# Altium schematic sheet MotorCell_noPow.SchDoc
size A3; SheetNumber: 3
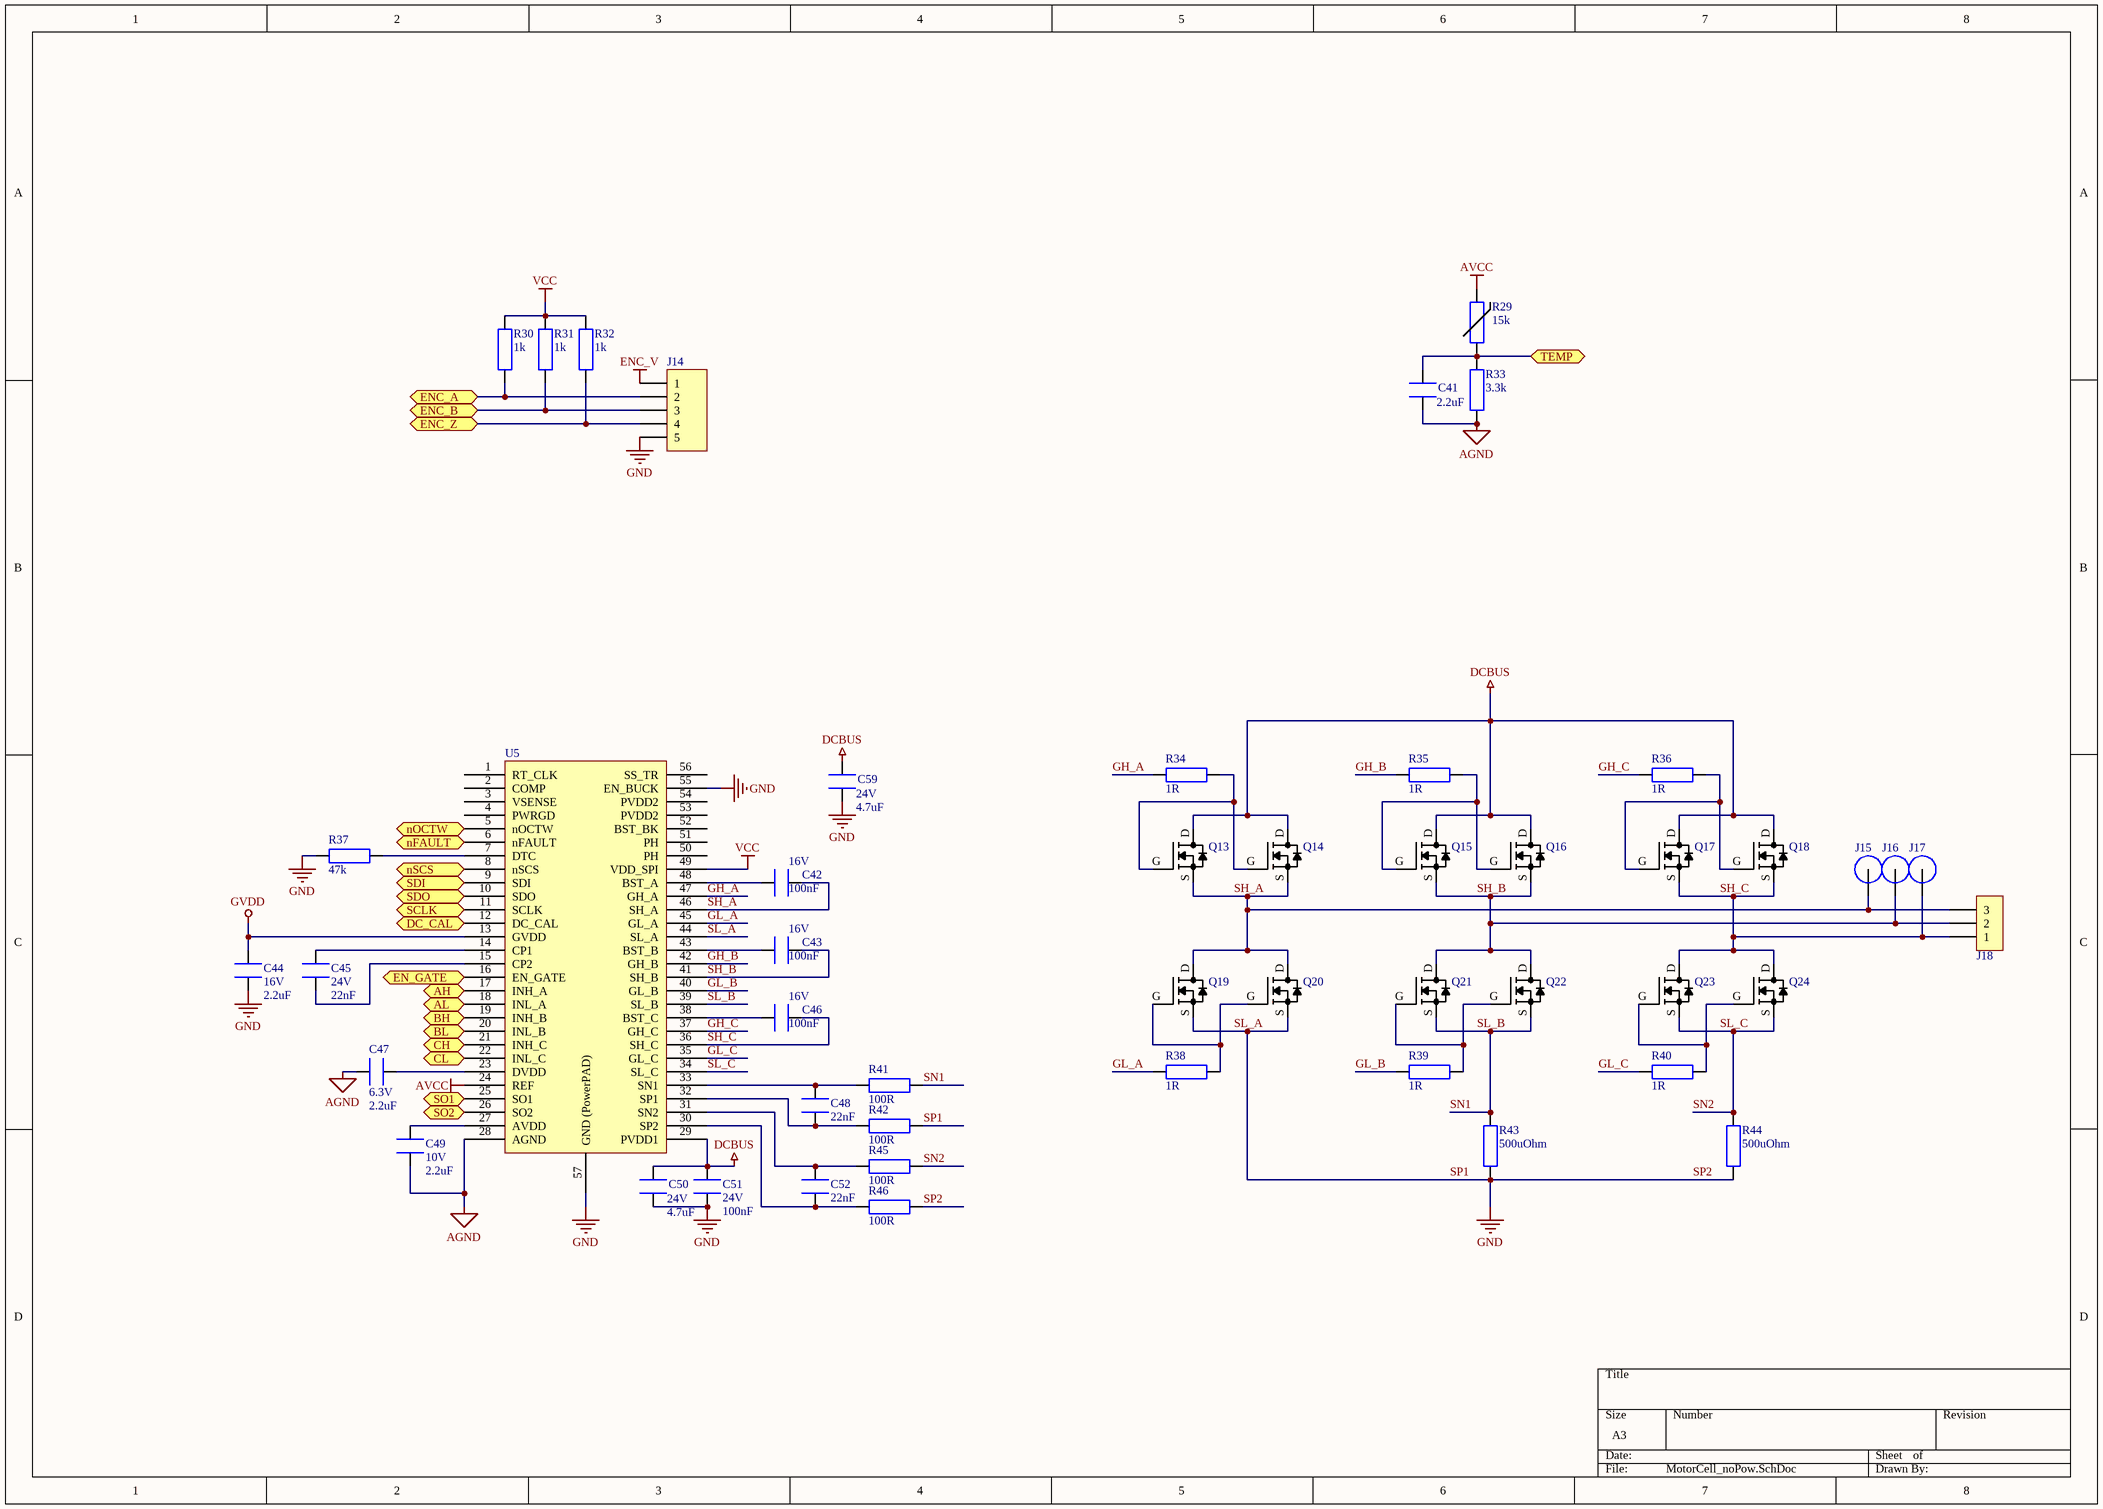
[diagram p0: MotorCell_noPow.SchDoc]

## Parts
C41  value 2.2uF  [1608[0603]]
C42  16V  value 100nF  [1608[0603]]
C43  16V  value 100nF  [1608[0603]]
C44  16V  value 2.2uF  [1608[0603]]
C45  24V  value 22nF  [1608[0603]]
C46  16V  value 100nF  [1608[0603]]
C47  6.3V  value 2.2uF  [1608[0603]]
C48  value 22nF  [1608[0603]]
C49  10V  value 2.2uF  [1608[0603]]
C50  24V  value 4.7uF  [CAPC2012X09N]
C51  24V  value 100nF  [1608[0603]]
C52  value 22nF  [1608[0603]]
C59  24V  value 4.7uF  [CAPC2012X09N]
J14  (no value)  [HDR1X5]
J15  (no value)  [M3 Spade Hole]
J16  (no value)  [M3 Spade Hole]
J17  (no value)  [M3 Spade Hole]
J18  (no value)  [MC000051]
Q13  (no value)  [SO8FL]
Q14  (no value)  [SO8FL_FILL]
Q15  (no value)  [SO8FL]
Q16  (no value)  [SO8FL_FILL]
Q17  (no value)  [SO8FL]
Q18  (no value)  [SO8FL_FILL]
Q19  (no value)  [SO8FL]
Q20  (no value)  [SO8FL]
Q21  (no value)  [SO8FL]
Q22  (no value)  [SO8FL]
Q23  (no value)  [SO8FL]
Q24  (no value)  [SO8FL]
R29  value 15k  [RESC1608X06L]
R30  value 1k  [RESC1608X55N]
R31  value 1k  [RESC1608X55N]
R32  value 1k  [RESC1608X55N]
R33  value 3.3k  [RESC1608X55N]
R34  value 1R  [RESC1608X55N]
R35  value 1R  [RESC1608X55N]
R36  value 1R  [RESC1608X55N]
R37  value 47k  [RESC1608X55N]
R38  value 1R  [RESC1608X55N]
R39  value 1R  [RESC1608X55N]
R40  value 1R  [RESC1608X55N]
R41  value 100R  [RESC1608X55N]
R42  value 100R  [RESC1608X55N]
R43  value 500uOhm  [RESC6432X09N]
R44  value 500uOhm  [RESC6432X09N]
R45  value 100R  [RESC1608X55N]
R46  value 100R  [RESC1608X55N]
U5  (no value)  [TSSOP50P810X120_HS-57N]

## Ports
AH, AL, BH, BL, CH, CL, DC_CAL, EN_GATE, ENC_A, ENC_B, ENC_Z, nFAULT, nOCTW, nSCS, SCLK, SDI, SDO, SO1, SO2, TEMP

## Nets
AGND: C41.1 C47.1 C49.1 R33.2 U5.28(AGND)
AVCC: R29.2 U5.24(REF)
DCBUS: C50.2 C51.1 C59.2 Q13.D Q14.D Q15.D Q16.D Q17.D Q18.D U5.29(PVDD1)
ENC_V: J14.1
GVDD: C44.2 U5.13(GVDD)
SL_A: C44.1 C50.1 C51.2 C59.1 J14.5 Q19.S Q20.S R37.2 R42.1 R43.1 R44.1 R46.1 U5.44(SL_A) U5.55(EN_BUCK) U5.57(GND_(PowerPAD))  [also labelled GND, SP1, SP2]
VCC: R30.1 R31.1 R32.1 U5.49(VDD_SPI)
AH: U5.17(INH_A) ; port AH
AL: U5.18(INL_A) ; port AL
BH: U5.19(INH_B) ; port BH
BL: U5.20(INL_B) ; port BL
CH: U5.21(INH_C) ; port CH
CL: U5.22(INL_C) ; port CL
DC_CAL: U5.12(DC_CAL) ; port DC_CAL
EN_GATE: U5.16(EN_GATE) ; port EN_GATE
ENC_A: J14.2 R30.2 ; port ENC_A
ENC_B: J14.3 R31.2 ; port ENC_B
ENC_Z: J14.4 R32.2 ; port ENC_Z
GH_A: R34.1 U5.47(GH_A)
GH_B: R35.1 U5.42(GH_B)
GH_C: R36.1 U5.37(GH_C)
GL_A: R38.1 U5.45(GL_A)
GL_B: R39.1 U5.40(GL_B)
GL_C: R40.1 U5.35(GL_C)
nFAULT: U5.6(nFAULT) ; port nFAULT
nOCTW: U5.5(nOCTW) ; port nOCTW
nSCS: U5.8(nSCS) ; port nSCS
SCLK: U5.11(SCLK) ; port SCLK
SDI: U5.9(SDI) ; port SDI
SDO: U5.10(SDO) ; port SDO
SH_A: C42.1 J15.1 J18.3 Q13.S Q14.S Q19.D Q20.D U5.46(SH_A)
SH_B: C43.1 J16.1 J18.2 Q15.S Q16.S Q21.D Q22.D U5.41(SH_B)
SH_C: C46.1 J17.1 J18.1 Q17.S Q18.S Q23.D Q24.D U5.36(SH_C)
SL_B: Q21.S Q22.S R41.1 R43.2 U5.39(SL_B)  [also labelled SN1]
SL_C: Q23.S Q24.S R44.2 R45.1 U5.34(SL_C)  [also labelled SN2]
SO1: U5.25(SO1) ; port SO1
SO2: U5.26(SO2) ; port SO2
TEMP: C41.2 R29.1 R33.1 ; port TEMP
NetC42_2: C42.2 U5.48(BST_A)
NetC43_2: C43.2 U5.43(BST_B)
NetC45_1: C45.1 U5.14(CP1)
NetC45_2: C45.2 U5.15(CP2)
NetC46_2: C46.2 U5.38(BST_C)
NetC47_2: C47.2 U5.23(DVDD)
NetC48_1: C48.1 R41.2 U5.33(SN1)
NetC48_2: C48.2 R42.2 U5.32(SP1)
NetC49_2: C49.2 U5.27(AVDD)
NetC52_1: C52.1 R45.2 U5.31(SN2)
NetC52_2: C52.2 R46.2 U5.30(SP2)
NetQ13_G: Q13.G Q14.G R34.2
NetQ15_G: Q15.G Q16.G R35.2
NetQ17_G: Q17.G Q18.G R36.2
NetQ19_G: Q19.G Q20.G R38.2
NetQ21_G: Q21.G Q22.G R39.2
NetQ23_G: Q23.G Q24.G R40.2
NetR37_1: R37.1 U5.7(DTC)

Not connected (* = marked no-connect by the designer): U5 1(RT_CLK) 2(COMP) 3(VSENSE) 4(PWRGD) 50(PH) 51(PH) 52(BST_BK) 53(PVDD2) 54(PVDD2) 56(SS_TR)

## Library data of the parts
C41-C49 C51 C52 = CAP_0603: CAP General 0603
C50 C59 = GRM219R6YA475KA73D: CAP CER 4.7UF 35V X5R 0805
J14 = Header 5: Header, 5-Pin; LatestRevisionDate: 17-Jul-2002; LatestRevisionNote: Re-released for DXP Platform.; Publisher: Altium Limited
J15-J17 = M3 Spade Terminal
J18 = MC000051: TERMINAL BLOCK, WIRE TO BRD, 3POS, 10AWG; Supplier 1: Farnell; Supplier Part Number 1: 2008022
Q13-Q24 = NTMFS4937NT1G: MOSFET, N CH, 30V, 70A, SO-8 FL; Supplier 1: Farnell; Supplier Part Number 1: 2317605; Supplier 2: Farnell; Supplier Part Number 2: 2317605RL
R29 = NTCS0603E3153JMT: THERMISTOR, 15K, 5%, SMD, NTC; Supplier 1: Farnell; Supplier Part Number 1: 2103168
R30-R42 R45 R46 = RES_0603: RES General 1% 0603
R43 R44 = CSR2512C0R0005F: RES SMD 0.0005 OHM 1% 3W 2512
U5 = DRV8301: MOTOR DRIVER, 3PH, 56HTSSOP